# Altium schematic sheet MCU.SchDoc
size A3
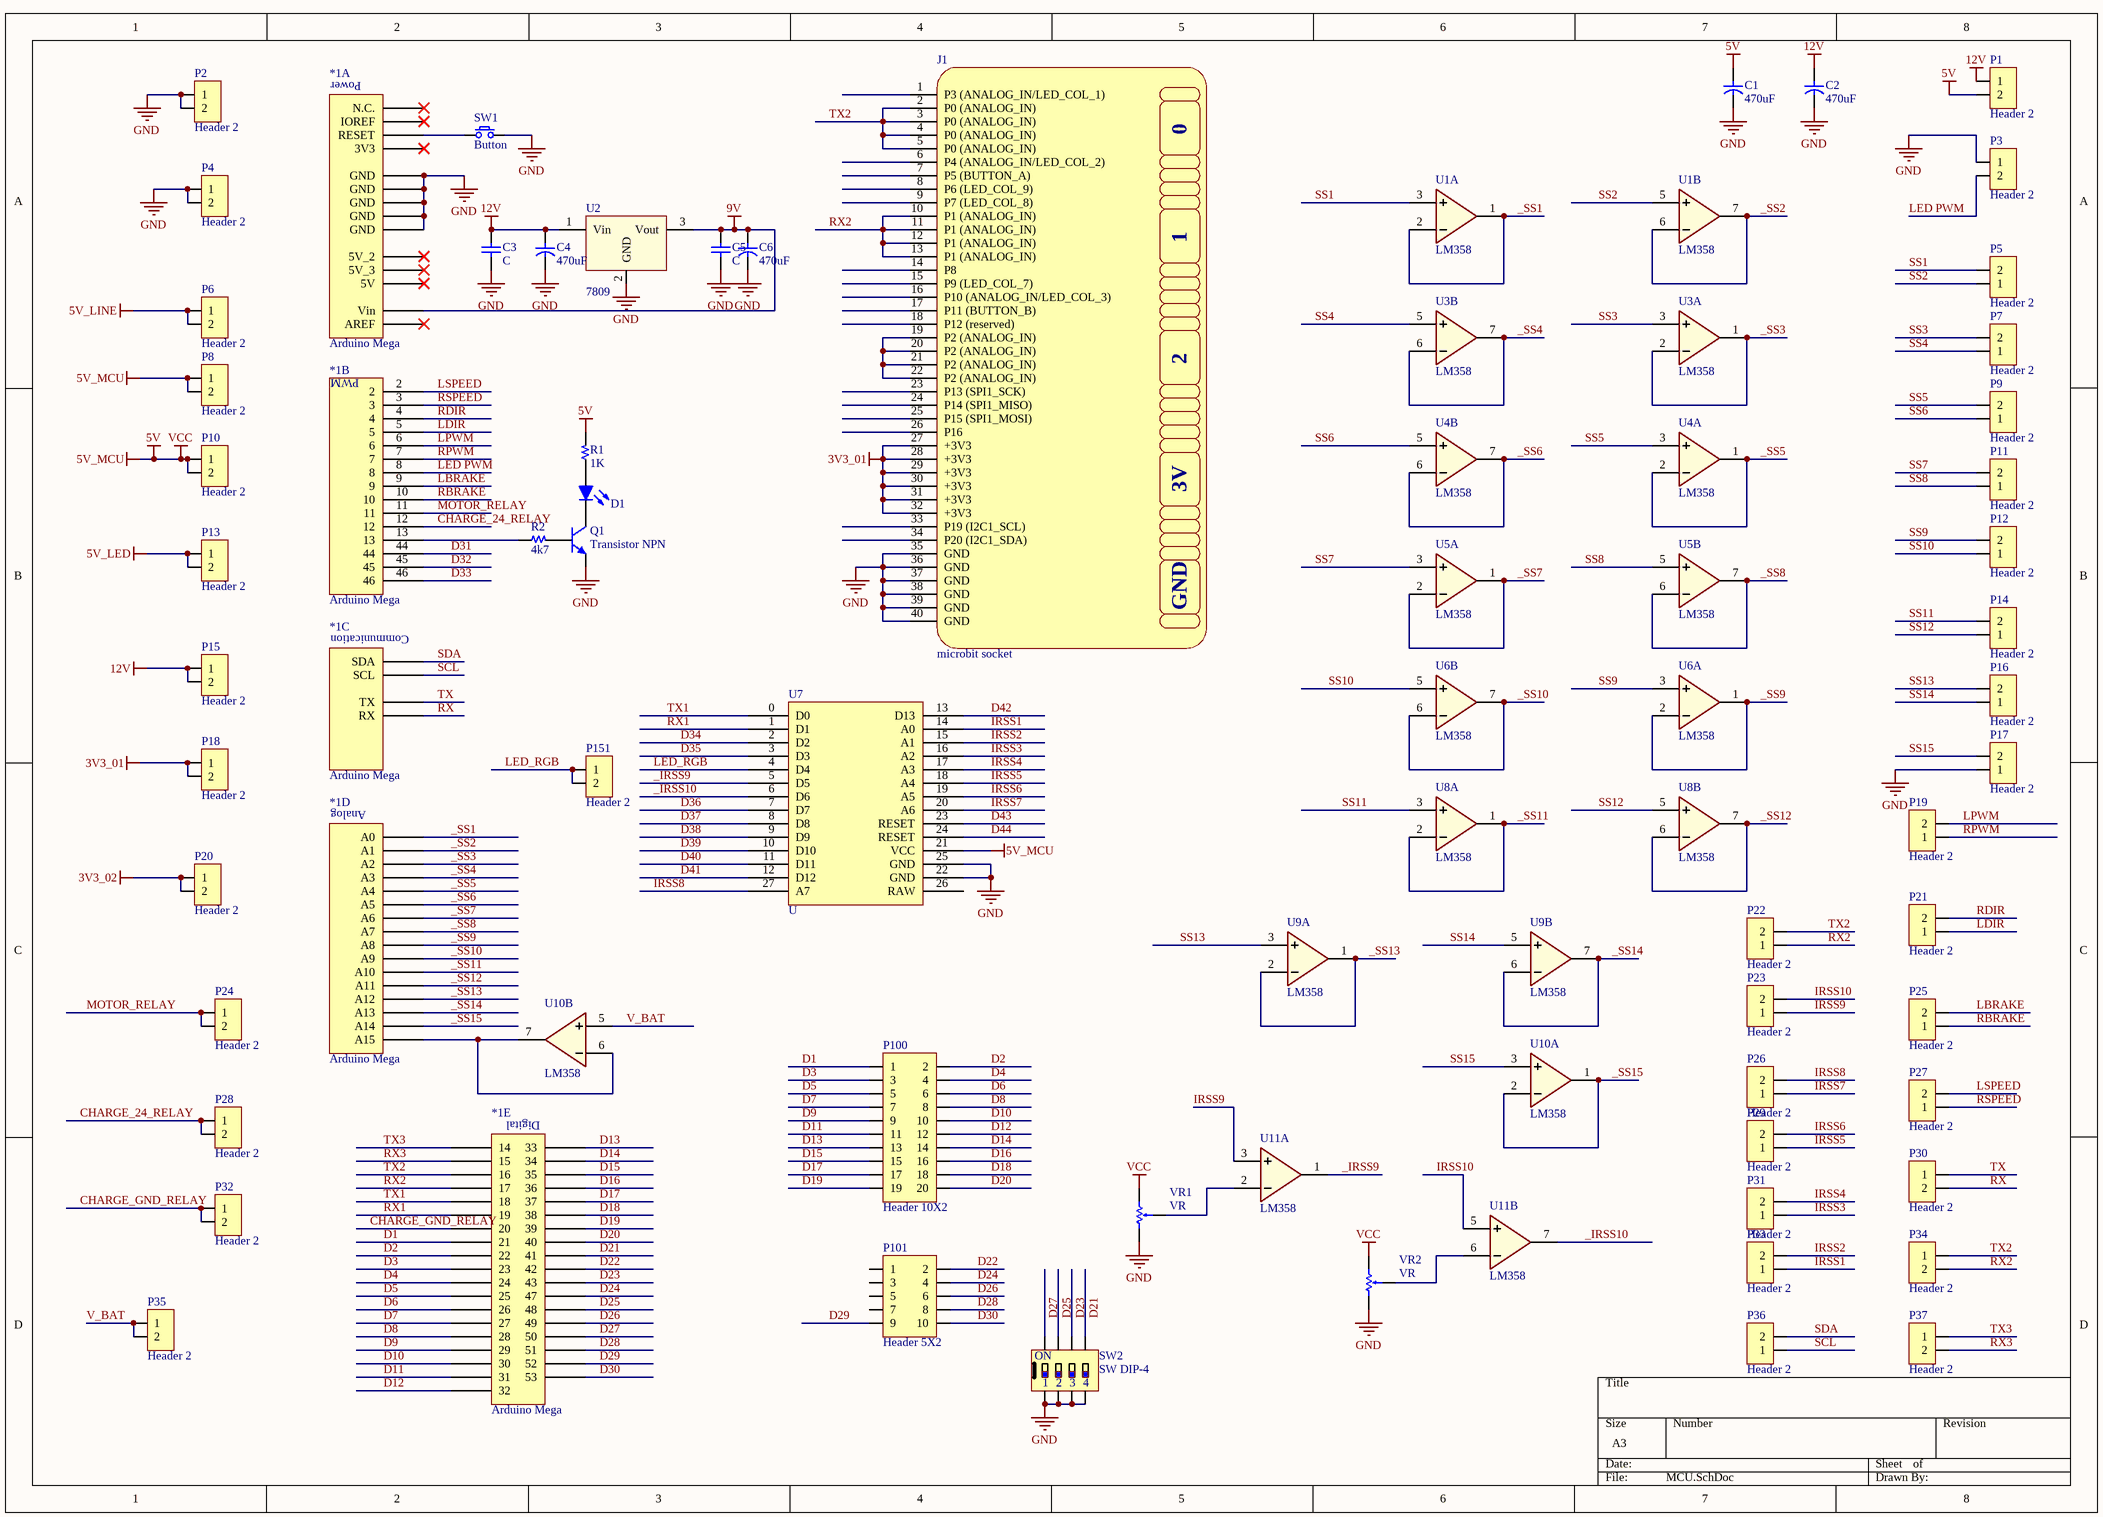
[diagram p0: MCU.SchDoc]

## Parts
*1  Arduino Mega  [Arduino Mega]  (parts A,B,C,D,E of 5)
C1  470uF  [C SMD ALU (F) DUAL]
C2  470uF  [C SMD ALU (F) DUAL]
C3  C  [C 0805]
C4  470uF  [C SMD ALU (F) DUAL]
C5  C  [C 0805]
C6  470uF  [C SMD ALU (F) DUAL]
D1  Led  [Led 0805]  (value not drawn)
J1  microbit socket  [CONN/MIC127-140-001]
P1  Header 2  [HDR Domino 2]
P2  Header 2  [HDR Domino 2]
P3  Header 2  [HDR Domino 2]
P4  Header 2  [HDR Domino 2]
P5  Header 2  [HDR Domino 2]
P6  Header 2  [HDR Domino 2]
P7  Header 2  [HDR Domino 2]
P8  Header 2  [HDR Domino 2]
P9  Header 2  [HDR Domino 2]
P10  Header 2  [HDR Domino 2]
P11  Header 2  [HDR Domino 2]
P12  Header 2  [HDR Domino 2]
P13  Header 2  [HDR Domino 2]
P14  Header 2  [HDR Domino 2]
P15  Header 2  [HDR Domino 2]
P16  Header 2  [HDR Domino 2]
P17  Header 2  [HDR Domino 2]
P18  Header 2  [HDR Domino 2]
P19  Header 2  [HDR Domino 2]
P20  Header 2  [HDR Domino 2]
P21  Header 2  [HDR Domino 2]
P22  Header 2  [HDR Domino 2]
P23  Header 2  [HDR Domino 2]
P24  Header 2  [HDR Domino 2]
P25  Header 2  [HDR Domino 2]
P26  Header 2  [HDR Domino 2]
P27  Header 2  [HDR Domino 2]
P28  Header 2  [HDR Domino 2]
P29  Header 2  [HDR Domino 2]
P30  Header 2  [HDR Domino 2]
P31  Header 2  [HDR Domino 2]
P32  Header 2  [HDR Domino 2]
P33  Header 2  [HDR Domino 2]
P34  Header 2  [HDR Domino 2]
P35  Header 2  [HDR Domino 2]
P36  Header 2  [HDR Domino 2]
P37  Header 2  [HDR Domino 2]
P100  Header 10X2  [HDR/Header/20/DL/BOX]
P101  Header 5X2  [HDR/Header/10/DL/BOX]
P151  Header 2  [HDR Domino 2]
Q1  Transistor NPN  [SOT-23]
R1  1K  [R 0805]
R2  4k7  [R 0805]
SW1  Button  [SW/2/SMD]
SW2  SW DIP-4  [SW/DIP4]
U1  LM358  [SOIC-8]  (parts A,B of 2)
U2  7809  [TO-252 (DPAK)]
U3  LM358  [SOIC-8]  (parts A,B of 2)
U4  LM358  [SOIC-8]  (parts A,B of 2)
U5  LM358  [SOIC-8]  (parts A,B of 2)
U6  LM358  [SOIC-8]  (parts A,B of 2)
U7  U  [PRO MINI]
U8  LM358  [SOIC-8]  (parts A,B of 2)
U9  LM358  [SOIC-8]  (parts A,B of 2)
U10  LM358  [SOIC-8]  (parts A,B of 2)
U11  LM358  [SOIC-8]  (parts A,B of 2)
VR1  VR  [R VAR E]
VR2  VR  [R VAR E]

## Nets
3V3_01: J1.27(+3V3) J1.28(+3V3) J1.29(+3V3) J1.30(+3V3) J1.31(+3V3) J1.32(+3V3) P18.1 P18.2
3V3_02: P20.1 P20.2
5V: C1.1 P1.2 P8.1 P8.2 P10.1 P10.2 R1.2 U1.8(VCC) U3.8(VCC) U4.8(VCC) U5.8(VCC) U6.8(VCC) U7.21(VCC) U8.8(VCC) U9.8(VCC) U10.8(VCC) U11.8(VCC) VR1.1 VR2.1  [also labelled 5V_MCU, VCC]
5V_LED: P13.1 P13.2
5V_LINE: P6.1 P6.2
9V: *1.Vin C5.1 C6.1 U2.3(Vout)
12V: C2.1 C3.1 C4.1 P1.1 P15.1 P15.2 U2.1(Vin)
GND: *1.GND1(GND) *1.GND2(GND) *1.GND3(GND) *1.GND4(GND) *1.GND5(GND) C1.2 C2.2 C3.2 C4.2 C5.2 C6.2 J1.35(GND) J1.36(GND) J1.37(GND) J1.38(GND) J1.39(GND) J1.40(GND) P2.1 P2.2 P3.1 P4.1 P4.2 P17.1 Q1.2(E) SW1.2 SW2.1 SW2.2 SW2.3 SW2.4 U1.4(GND) U2.2(GND) U3.4(GND) U4.4(GND) U5.4(GND) U6.4(GND) U7.22(GND) U7.25(GND) U8.4(GND) U9.4(GND) U10.4(GND) U11.4(GND) VR1.3 VR2.3
_IRSS9: U7.5(D5) U11.1(OutA)
_IRSS10: U7.6(D6) U11.7(OutB)
_SS1: *1.A0 U1.1(OutA) U1.2(A-)
_SS2: *1.A1 U1.6(B-) U1.7(OutB)
_SS3: *1.A2 U3.1(OutA) U3.2(A-)
_SS4: *1.A3 U3.6(B-) U3.7(OutB)
_SS5: *1.A4 U4.1(OutA) U4.2(A-)
_SS6: *1.A5 U4.6(B-) U4.7(OutB)
_SS7: *1.A6 U5.1(OutA) U5.2(A-)
_SS8: *1.A7 U5.6(B-) U5.7(OutB)
_SS9: *1.A8 U6.1(OutA) U6.2(A-)
_SS10: *1.A9 U6.6(B-) U6.7(OutB)
_SS11: *1.A10 U8.1(OutA) U8.2(A-)
_SS12: *1.A11 U8.6(B-) U8.7(OutB)
_SS13: *1.A12 U9.1(OutA) U9.2(A-)
_SS14: *1.A13 U9.6(B-) U9.7(OutB)
_SS15: *1.A14 U10.1(OutA) U10.2(A-)
CHARGE_24_RELAY: *1.12 P28.1 P28.2
CHARGE_GND_RELAY: *1.20 P32.1 P32.2
D1: *1.21 P100.1
D2: *1.22 P100.2
D3: *1.23 P100.3
D4: *1.24 P100.4
D5: *1.25 P100.5
D6: *1.26 P100.6
D7: *1.27 P100.7
D8: *1.28 P100.8
D9: *1.29 P100.9
D10: *1.30 P100.10
D11: *1.31 P100.11
D12: *1.32 P100.12
D13: *1.33 P100.13
D14: *1.34 P100.14
D15: *1.35 P100.15
D16: *1.36 P100.16
D17: *1.37 P100.17
D18: *1.38 P100.18
D19: *1.39 P100.19
D20: *1.40 P100.20
D21: *1.41 SW2.5
D22: *1.42 P101.2
D23: *1.43 SW2.6
D24: *1.47 P101.4
D25: *1.48 SW2.7
D26: *1.49 P101.6
D27: *1.50 SW2.8
D28: *1.51 P101.8
D29: *1.52 P101.9
D30: *1.53 P101.10
D31: *1.44
D32: *1.45
D33: *1.46
D34: U7.2(D2)
D35: U7.3(D3)
D36: U7.7(D7)
D37: U7.8(D8)
D38: U7.9(D9)
D39: U7.10(D10)
D40: U7.11(D11)
D41: U7.12(D12)
D42: U7.13(D13)
D43: U7.23(RESET)
D44: U7.24(RESET)
IRSS1: P33.1 U7.14(A0)
IRSS2: P33.2 U7.15(A1)
IRSS3: P31.1 U7.16(A2)
IRSS4: P31.2 U7.17(A3)
IRSS5: P29.1 U7.18(A4)
IRSS6: P29.2 U7.19(A5)
IRSS7: P26.1 U7.20(A6)
IRSS8: P26.2 U7.27(A7)
IRSS9: P23.1 U11.3(A+)
IRSS10: P23.2 U11.5(B+)
LBRAKE: *1.9 P25.2
LDIR: *1.5 P21.1
LED PWM: *1.8 P3.2
LED_RGB: P151.1 P151.2 U7.4(D4)
LPWM: *1.6 P19.2
LSPEED: *1.2 P27.2
MOTOR_RELAY: *1.11 P24.1 P24.2
RBRAKE: *1.10 P25.1
RDIR: *1.4 P21.2
RPWM: *1.7 P19.1
RSPEED: *1.3 P27.1
RX: *1.0(RX) P30.2
RX1: *1.19 U7.1(D1)
RX2: *1.17 J1.10(P1_(ANALOG_IN)) J1.11(P1_(ANALOG_IN)) J1.12(P1_(ANALOG_IN)) J1.13(P1_(ANALOG_IN)) P22.1 P34.2
RX3: *1.15 P37.2
SCL: *1.SCL P36.1
SDA: *1.SDA P36.2
SS1: P5.2 U1.3(A+)
SS2: P5.1 U1.5(B+)
SS3: P7.2 U3.3(A+)
SS4: P7.1 U3.5(B+)
SS5: P9.2 U4.3(A+)
SS6: P9.1 U4.5(B+)
SS7: P11.2 U5.3(A+)
SS8: P11.1 U5.5(B+)
SS9: P12.2 U6.3(A+)
SS10: P12.1 U6.5(B+)
SS11: P14.2 U8.3(A+)
SS12: P14.1 U8.5(B+)
SS13: P16.2 U9.3(A+)
SS14: P16.1 U9.5(B+)
SS15: P17.2 U10.3(A+)
TX: *1.1(TX) P30.1
TX1: *1.18 U7.0(D0)
TX2: *1.16 J1.2(P0_(ANALOG_IN)) J1.3(P0_(ANALOG_IN)) J1.4(P0_(ANALOG_IN)) J1.5(P0_(ANALOG_IN)) P22.2 P34.1
TX3: *1.14 P37.1
V_BAT: P35.1 P35.2 U10.5(B+)
Net*1_13: *1.13 R2.1
Net*1_A15: *1.A15 U10.6(B-) U10.7(OutB)
Net*1_RESET: *1.RESET SW1.1
NetD1_1: D1.1(A) R1.1
NetD1_2: D1.2(K) Q1.3(C)
NetJ1_19: J1.19(P2_(ANALOG_IN)) J1.20(P2_(ANALOG_IN)) J1.21(P2_(ANALOG_IN)) J1.22(P2_(ANALOG_IN))
NetQ1_1: Q1.1(B) R2.2
NetU11_2: U11.2(A-) VR1.2
NetU11_6: U11.6(B-) VR2.2

Not connected (* = marked no-connect by the designer): *1 3V3* 5V* 5V_2* 5V_3* AREF* IOREF* NC(N.C.)*; J1 1(P3_(ANALOG_IN/LED_COL_1)) 6(P4_(ANALOG_IN/LED_COL_2)) 7(P5_(BUTTON_A)) 8(P6_(LED_COL_9)) 9(P7_(LED_COL_8)) 14(P8) 15(P9_(LED_COL_7)) 16(P10_(ANALOG_IN/LED_COL_3)) 17(P11_(BUTTON_B)) 18(P12_(reserved)) 23(P13_(SPI1_SCK)) 24(P14_(SPI1_MISO)) 25(P15_(SPI1_MOSI)) 26(P16) 33(P19_(I2C1_SCL)) 34(P20_(I2C1_SDA)); P101 1 3 5 7; U7 26(RAW)

## Notes on the sheet
- (in symbol Arduino Mega, part A) Power
- (in symbol Arduino Mega, part B) PWM
- (in symbol Arduino Mega, part C) Communication
- (in symbol Arduino Mega, part D) Analog
- (in symbol Arduino Mega, part E) Digital
- (in symbol CON MICROBIT) 0; 3V
- (in symbol SW DIP-4) ON

## Library data of the parts
C1 C2 C4 C6 = Capacitor: Capacitor pol
C3 C5 = Capacitor NP: Capacitor non-pol
D1 = Led: Typical LED
J1 = CON MICROBIT: microbit socket 40 pins
P1-P37 P151 = Header 2: Header, 2-Pin; LatestRevisionDate: 17-Jul-2002; LatestRevisionNote: Re-released for DXP Platform.; Publisher: Altium Limited
P100 = Header 10X2: Header, 10-Pin, Dual row
P101 = Header 5X2: Header, 5-Pin, Dual row
Q1 = Transistor NPN: NPN Bipolar Transistor
R1 R2 = Resistor
SW1 = SW SPST: Tact switch 2 pin
U1 U3-U6 U8-U11 = LM358: Low Power Dual Operational Amplifiers
U2 = 78xx: LDO Fixed Voltage regulator
U7 = ProMini
VR1 VR2 = Resistor Variable